# Altium schematic sheet Filter.SchDoc
size A4
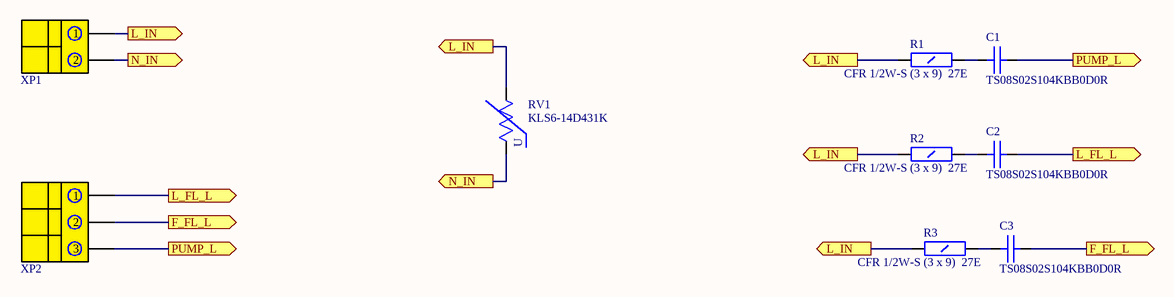
[diagram p0: Filter.SchDoc]

## Parts
C1  TS08S02S104KBB0D0R  [CAP_HV_13x5]
C2  TS08S02S104KBB0D0R  [CAP_HV_13x5]
C3  TS08S02S104KBB0D0R  [CAP_HV_13x5]
R1  СFR 1/2W-S (3 x 9)  27E  [RES_10x4_THD]
R2  СFR 1/2W-S (3 x 9)  27E  [RES_10x4_THD]
R3  СFR 1/2W-S (3 x 9)  27E  [RES_10x4_THD]
RV1  KLS6-14D431K  [Varistor_14MM]
XP1  DG330-2P  [DG330-2P]  (value not drawn)
XP2  DG330-3PIN  [DG330-3P]  (value not drawn)

## Ports
F_FL_L (out), L_FL_L (out), L_IN (out), N_IN (out), PUMP_L (out)

## Nets
F_FL_L: C3.2(B) XP2.2 ; port F_FL_L
L_FL_L: C2.2(B) XP2.1 ; port L_FL_L
L_IN: R1.2(B) R2.2(B) R3.2(B) RV1.2(B) XP1.1 ; port L_IN
N_IN: RV1.1(A) XP1.2 ; port N_IN
PUMP_L: C1.2(B) XP2.3 ; port PUMP_L
NetC1_1: C1.1(A) R1.1(A)
NetC2_1: C2.1(A) R2.1(A)
NetC3_1: C3.1(A) R3.1(A)

## Notes on the sheet
- (in symbol KLS6-14D431K) U

## Library data of the parts
C1-C3 = CAP_HV_13x5: Value: TS08S02S104KBB0D0R
R1-R3 = RC_1003_THR: THR resisto r10x3mm 0.5W; Value: СFR 1/2W-S (3 x 9)  27E
RV1 = KLS6-14D431K: Varistor diameter 14mm; Value: KLS6-14D431K
XP1 = DG330-2P: Degson 2 pin connector rear; Value: DG330-2P
XP2 = DG330-3P: Degson 3 pin connector rear; Value: DG330-3PIN